# EAGLE design WearablesVCNL4020 (EAGLE 7.6.0)
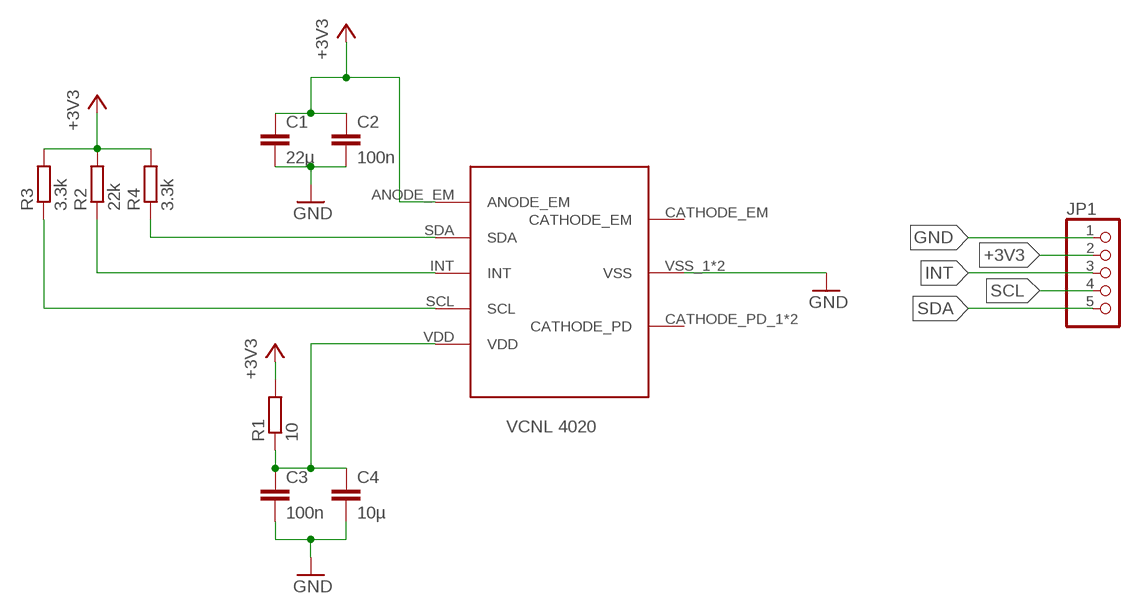
[diagram p0: schematic, sheet 1]

## Parts
C1  22µ  C-EUC0805  [C0805]
C2  100n  C-EUC0805  [C0805]
C3  100n  C-EUC0805  [C0805]
C4  10µ  C-EUC0805  [C0805]
JP1  PINHD-1X5/90  [1X05/90]
R1  10  R-EU_R0805  [R0805]
R2  22k  R-EU_R0805  [R0805]
R3  3.3k  R-EU_R0805  [R0805]
R4  3.3k  R-EU_R0805  [R0805]
U$1  VCNL4020  [VCNL4020]

## Nets
+3V3: C1.1 C2.1 JP1.2 R1.2 R2.2 R3.2 R4.2 U$1.ANODE_EM
GND: C1.2 C2.2 C3.2 C4.2 JP1.1 U$1.VSS_1(VSS) U$1.VSS_2(VSS)
INT: JP1.3 R2.1 U$1.INT
SCL: JP1.4 R3.1 U$1.SCL
SDA: JP1.5 R4.1 U$1.SDA
VDD: C3.1 C4.1 R1.1 U$1.VDD
Unconnected: U$1.CATHODE_EM U$1.CATHODE_PD_1(CATHODE_PD) U$1.CATHODE_PD_2(CATHODE_PD)

## Notes on the sheet
- VCNL 4020

## Library data of the parts
C1-C4 = resistor:C-EU: CAPACITOR, European symbol
JP1 = pinhead:PINHD-1X5: PIN HEADER
R1-R4 = resistor:R-EU_: RESISTOR, European symbol
U$1 = VCNL4020:VCNL4020

## Board
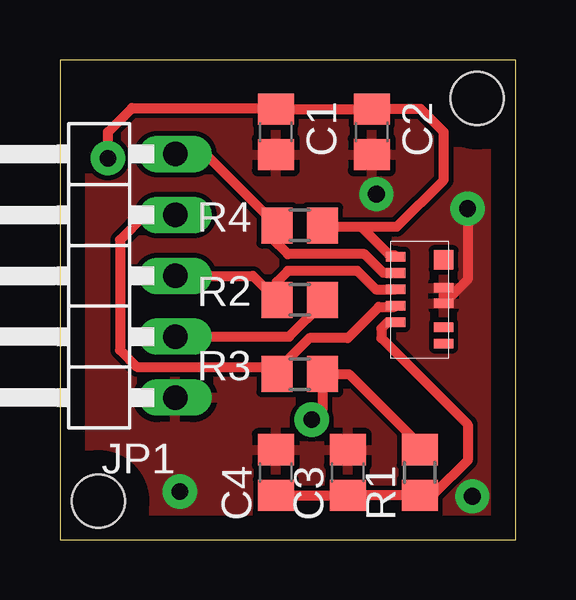
[diagram p1: board, top side]
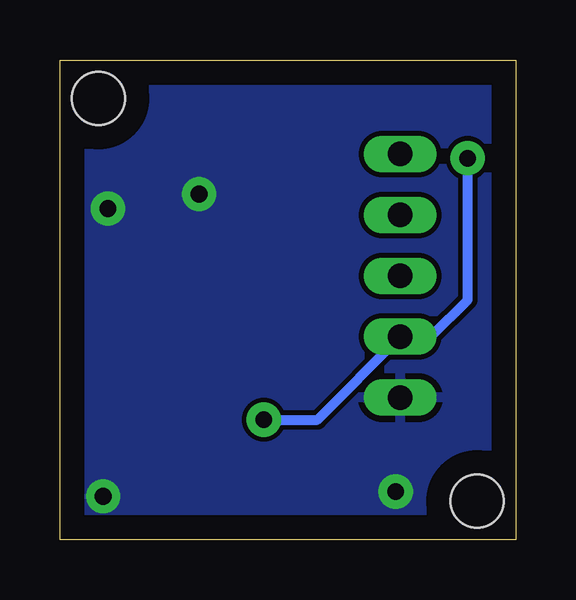
[diagram p2: board, bottom side, seen from below]

Size 19 x 20 mm. Coordinates in mm from the lower left corner, seen from the top.
Outline: 0,0 19,0 19,20 0,20 0,0
Copper layers (1*16): Top 0.035mm / dielectric 1.5mm / Bottom 0.035mm
Design rules "default": minimum track width 10mil, minimum drill 24mil, track to track 8mil, track to pad 8mil, pad to pad 8mil, via to via 8mil, smd to smd 8mil, copper to edge 40mil, drill to drill 8mil, minimum pad ring 10mil, minimum via ring 8mil, stop-mask expansion 4mil, vias tented up to drill 0mil, thermal gap 10mil
Holes 2.2 mm at 1.6,1.6 17.4,18.4

### Footprints (pad centres in the part's own frame; a part is rotated, then mirrored left to right if it is on the bottom)
C0805 = smd 1.3 x 1.5: 1 -0.95,0; 2 0.95,0
1X05/90 = drill 1.016 long: 1 -5.08,-3.81; 2 -2.54,-3.81; 3 0,-3.81; 4 2.54,-3.81; 5 5.08,-3.81
R0805 = smd 1.3 x 1.5: 1 -0.95,0; 2 0.95,0
VCNL4020 = smd 0.4 x 0.8: ANODE_EM -1.8,-1; CATHODE_PD_1 1.15,1; CATHODE_PD_2 1.83,1; INT -0.43,-1; SCL 0.255,-1; SDA -1.115,-1; VDD 0.94,-1; VSS_1 -0.5,1; VSS_2 0.15,1 | smd 0.8 x 0.83: CATHODE_EM -1.665,1

### Placement (x,y rotation side)
C1  9,17 270 top
C2  13,17 270 top
C3  12,2.8 90 top
C4  9,2.8 90 top
JP1  1,11 90 top
R1  15,2.8 90 top
R2  10,10 0 top
R3  10,6.9 0 top
R4  10,13.1 0 top
U$1  15,10 270 top

### Tracks (layer width: path | path; a pad name or v marks a point on that pad's centre or on a via)
+3V3  (via drill 0.7 pad 1.42)
  Top 0.406: JP1.2 9.56,8.46 10.95,9.85 R2.2 | v10.5,5 10.95,5.45 R3.2 12.05,6.9 15,3.95 R1.2 | 10.8,13.25 R4.2 11.02,13.04 12.56,13.04 | U$1.ANODE_EM 14,11.84 13.76,11.84 12.56,13.04 | 12.56,13.04 14.04,13.04 16,15 16,17 15.05,17.95 C2.1 C1.1 8.95,18 3,18 2,17 v2,15.9
  Bottom 0.406: v10.5,5 8.27,5 JP1.2 3.54,8.46 2,10 v2,15.9
GND  (via drill 0.7 pad 1.42)
  Top 0.406: U$1.VSS_1 U$1.VSS_2 17,10.85 v17,13.8
  other vias: 13.2,14.4 17.2,1.8 5,2
  pour Top: 0,20 19,20 19,0 0,0
  pour Bottom: 0,20 19,20 19,0 0,0
INT
  Top 0.406: JP1.3 8.05,11 R2.1 9.05,10.75 9.5,11.2 12.4,11.2 13.17,10.43 U$1.INT
SCL
  Top 0.406: JP1.4 3.54,13.54 2.5,12.5 2.5,7.9 3.2,7.2 8.75,7.2 R3.1 9.05,7.35 9.35,7.35 10.4,8.4 12,8.4 13.3,9.7 13.96,9.7 U$1.SCL
SDA
  Top 0.406: 9,12.95 R4.1 | JP1.5 6.07,16.08 R4.1 | U$1.SDA 13.48,11.12 12.7,11.9 9.5,11.9 8.8,12.6 8.8,12.85 R4.1
VDD
  Top 0.406: C4.1 C3.1 R1.1 15.05,1.9 15.6,1.9 17,3.3 17,4.8 13.4,8.4 13.4,8.8 13.66,9.06 U$1.VDD